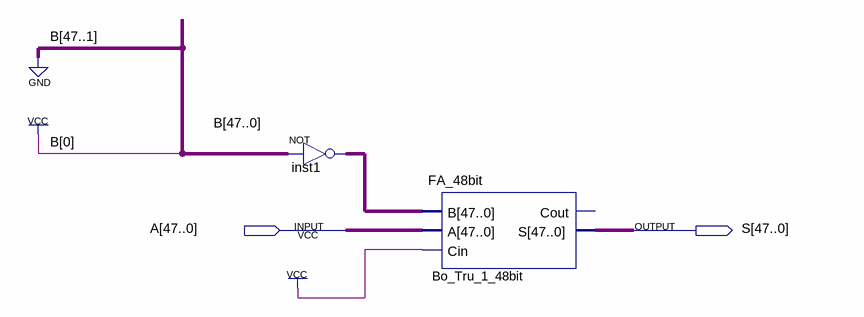
[diagram p0: schematic sheet]
// Quartus schematic BoTru_1_48bit.bdf as structural Verilog: 2 symbols, 2 pins
module BoTru_1_48bit (
  input  [47:0] A,
  output [47:0] S
);

  wire [47:0] inst1_out;

  assign inst1_out = ~48'b000000000000000000000000000000000000000000000001;  // NOT inst1, 48 bits wide
  FA_48bit Bo_Tru_1_48bit (.B(inst1_out), .A(A), .Cin(1'b1), .S(S));  // open: Cout
endmodule
